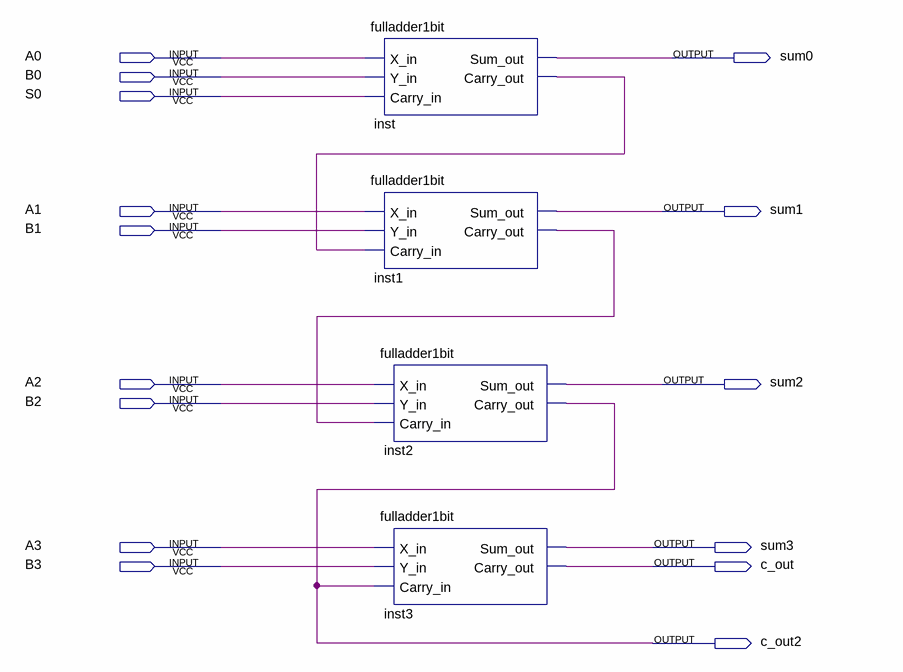
[diagram p0: schematic sheet]
// Quartus schematic fulladder4bits.bdf as structural Verilog: 4 symbols, 15 pins
module fulladder4bits (
  input  A0,
  input  B0,
  input  S0,
  input  A1,
  input  B1,
  input  A2,
  input  B2,
  input  A3,
  input  B3,
  output sum0,
  output sum1,
  output sum2,
  output sum3,
  output c_out,
  output c_out2
);

  wire inst1_carry_out, inst_carry_out;

  fulladder1bit inst (.X_in(A0), .Y_in(B0), .Carry_in(S0), .Sum_out(sum0), .Carry_out(inst_carry_out));
  fulladder1bit inst1 (.X_in(A1), .Y_in(B1), .Carry_in(inst_carry_out), .Sum_out(sum1), .Carry_out(inst1_carry_out));
  fulladder1bit inst2 (.X_in(A2), .Y_in(B2), .Carry_in(inst1_carry_out), .Sum_out(sum2), .Carry_out(c_out2));
  fulladder1bit inst3 (.X_in(A3), .Y_in(B3), .Carry_in(c_out2), .Sum_out(sum3), .Carry_out(c_out));
endmodule
